# Altium project BallSensor16.PrjPcb
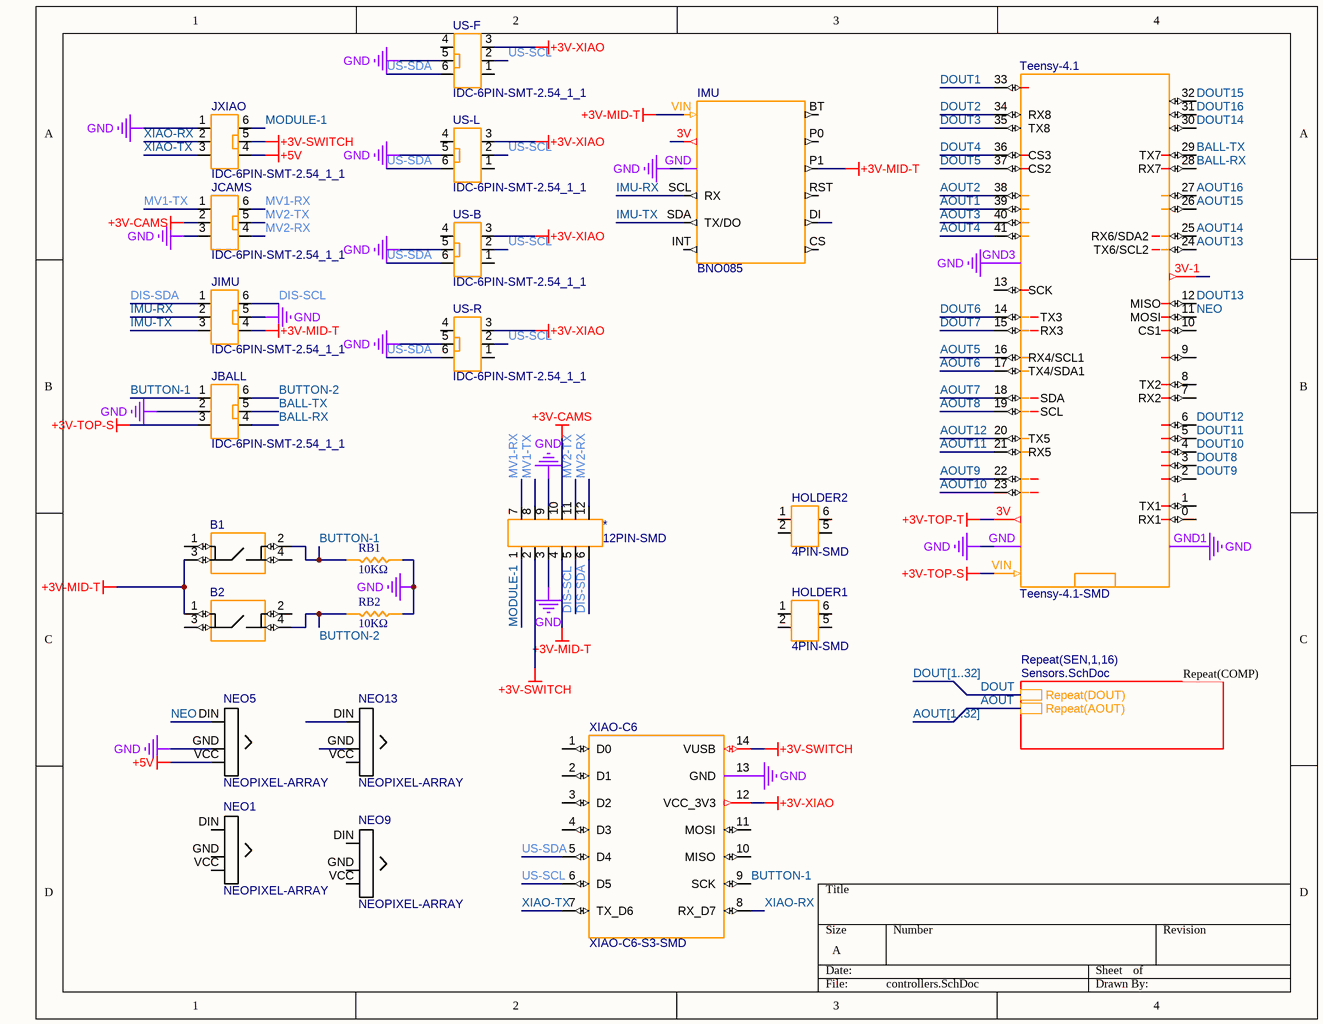
[diagram p0: controllers.SchDoc]
2 sheets, 86 parts. Net scope: hierarchical (ports join the sheet entries above them; power ports are global).
Board file: BallSensor16.PcbDoc
Sheets:
  controllers.SchDoc
    SEN1 = Sensors.SchDoc
    SEN2 = Sensors.SchDoc
    SEN3 = Sensors.SchDoc
    SEN4 = Sensors.SchDoc
    SEN5 = Sensors.SchDoc
    SEN6 = Sensors.SchDoc
    SEN7 = Sensors.SchDoc
    SEN8 = Sensors.SchDoc
    SEN9 = Sensors.SchDoc
    SEN10 = Sensors.SchDoc
    SEN11 = Sensors.SchDoc
    SEN12 = Sensors.SchDoc
    SEN13 = Sensors.SchDoc
    SEN14 = Sensors.SchDoc
    SEN15 = Sensors.SchDoc
    SEN16 = Sensors.SchDoc

## Sheet controllers.SchDoc
size A; SheetNumber: 1; SheetTotal: 2

### Parts
*  12PIN-SMD  [12PIN-SMD]
B1  BUTTON  [BUTTON]  (value not drawn)
B2  BUTTON  [BUTTON]  (value not drawn)
HOLDER1  4PIN-SMD  [4PIN-SMD]
HOLDER2  4PIN-SMD  [4PIN-SMD]
IMU  BNO085  [BNO085]
JBALL  IDC-6PIN-SMT-2.54_1_1  [IDC-6PIN-SMT-2.54]
JCAMS  IDC-6PIN-SMT-2.54_1_1  [IDC-6PIN-SMT-2.54]
JIMU  IDC-6PIN-SMT-2.54_1_1  [IDC-6PIN-SMT-2.54]
JXIAO  IDC-6PIN-SMT-2.54_1_1  [IDC-6PIN-SMT-2.54]
NEO1  NEOPIXEL-ARRAY  [NEOPIXEL-ARRAY]
NEO5  NEOPIXEL-ARRAY  [NEOPIXEL-ARRAY]
NEO9  NEOPIXEL-ARRAY  [NEOPIXEL-ARRAY]
NEO13  NEOPIXEL-ARRAY  [NEOPIXEL-ARRAY]
RB1  10KΩ  [RES_0603]
RB2  10KΩ  [RES_0603]
Teensy-4.1  Teensy-4.1-SMD  [TEENSY-4.1-SMD]
US-B  IDC-6PIN-SMT-2.54_1_1  [IDC-6PIN-SMT-2.54]
US-F  IDC-6PIN-SMT-2.54_1_1  [IDC-6PIN-SMT-2.54]
US-L  IDC-6PIN-SMT-2.54_1_1  [IDC-6PIN-SMT-2.54]
US-R  IDC-6PIN-SMT-2.54_1_1  [IDC-6PIN-SMT-2.54]
XIAO-C6  XIAO-C6-S3-SMD  [XIAO-C6-S3-SMD]

### Sub-sheets
Repeat(SEN,1,16) = Sensors.SchDoc: Repeat(DOUT), Repeat(AOUT)

### Nets
+3V-CAMS: *.10 JCAMS.2
+3V-MID-T: *.4 B1.3 B2.1 IMU.P1 IMU.VIN JIMU.4
+3V-SWITCH: *.2 JXIAO.5 XIAO-C6.14(VUSB)
+3V-TOP-S: JBALL.3 Teensy-4.1.VIN
+3V-TOP-T: Teensy-4.1.3V
+3V-XIAO: US-B.3 US-F.3 US-L.3 US-R.3 XIAO-C6.12(VCC_3V3)
+5V: JXIAO.4 NEO5.VCC
GND: *.3 *.9 IMU.GND JBALL.2 JCAMS.3 JIMU.5 JXIAO.1 NEO5.GND RB1.2 RB2.2 Teensy-4.1.GND Teensy-4.1.GND1 Teensy-4.1.GND3 US-B.5 US-F.5 US-L.5 US-R.5 XIAO-C6.13(GND)
AOUT: sheet Repeat(SEN,1,16)/Repeat(AOUT)
AOUT1: Teensy-4.1.39
AOUT2: Teensy-4.1.38
AOUT3: Teensy-4.1.40
AOUT4: Teensy-4.1.41
AOUT5: Teensy-4.1.16(RX4/SCL1)
AOUT6: Teensy-4.1.17(TX4/SDA1)
AOUT7: Teensy-4.1.18(SDA)
AOUT8: Teensy-4.1.19(SCL)
AOUT9: Teensy-4.1.22
AOUT10: Teensy-4.1.23
AOUT11: Teensy-4.1.21(RX5)
AOUT12: Teensy-4.1.20(TX5)
AOUT13: Teensy-4.1.24(TX6/SCL2)
AOUT14: Teensy-4.1.25(RX6/SDA2)
AOUT15: Teensy-4.1.26
AOUT16: Teensy-4.1.27
BALL-RX: JBALL.4 Teensy-4.1.28(RX7)
BALL-TX: JBALL.5 Teensy-4.1.29(TX7)
BUTTON-1: B1.2 JBALL.1 RB1.1 XIAO-C6.9(SCK)
BUTTON-2: B2.4 JBALL.6 RB2.1
DIS-SCL: *.5 JIMU.6
DIS-SDA: *.6 JIMU.1
DOUT: sheet Repeat(SEN,1,16)/Repeat(DOUT)
DOUT1: Teensy-4.1.33
DOUT2: Teensy-4.1.34(RX8)
DOUT3: Teensy-4.1.35(TX8)
DOUT4: Teensy-4.1.36(CS3)
DOUT5: Teensy-4.1.37(CS2)
DOUT6: Teensy-4.1.14(TX3)
DOUT7: Teensy-4.1.15(RX3)
DOUT8: Teensy-4.1.3
DOUT9: Teensy-4.1.2
DOUT10: Teensy-4.1.4
DOUT11: Teensy-4.1.5
DOUT12: Teensy-4.1.6
DOUT13: Teensy-4.1.12(MISO)
DOUT14: Teensy-4.1.30
DOUT15: Teensy-4.1.32
DOUT16: Teensy-4.1.31
IMU-RX: IMU.SCL(RX) JIMU.2
IMU-TX: IMU.SDA(TX/DO) JIMU.3
MODULE-1: *.1 JXIAO.6
MV1-RX: *.7 JCAMS.6
MV1-TX: *.8 JCAMS.1
MV2-RX: *.12 JCAMS.4
MV2-TX: *.11 JCAMS.5
NEO: NEO5.DIN Teensy-4.1.11(MOSI)
US-SCL: US-B.2 US-F.2 US-L.2 US-R.2 XIAO-C6.6(D5)
US-SDA: US-B.6 US-F.6 US-L.6 US-R.6 XIAO-C6.5(D4)
XIAO-RX: JXIAO.2 XIAO-C6.8(RX_D7)
XIAO-TX: JXIAO.3 XIAO-C6.7(TX_D6)

Not connected (* = marked no-connect by the designer): B1 1 4; B2 2 3; HOLDER1 1 2 5 6; HOLDER2 1 2 5 6; IMU 3V BT CS DI INT P0 RST; NEO1 DIN GND VCC; NEO9 DIN GND VCC; NEO13 DIN GND VCC; Teensy-4.1 0(RX1) 1(TX1) 3V-1 7(RX2) 8(TX2) 9 10(CS1) 13(SCK); US-B 1 4; US-F 1 4; US-L 1 4; US-R 1 4; XIAO-C6 1(D0) 2(D1) 3(D2) 4(D3) 10(MISO) 11(MOSI)

### Buses and harness runs
bus AOUT[1..32]
bus DOUT[1..32]

### Notes on the sheet
- Repeat(COMP)

### Library data of the parts
RB1 RB2 = RES_0603: Resistor SMD 0603 generic

## Sheet Sensors.SchDoc
size A; SheetNumber: 2; SheetTotal: 2
Used 16 times, as channels SEN1, SEN2, SEN3, SEN4, SEN5, SEN6, SEN7, SEN8, SEN9, SEN10, SEN11, SEN12, SEN13, SEN14, SEN15, SEN16. Parts and nets are listed once, with the designators drawn on the sheet.
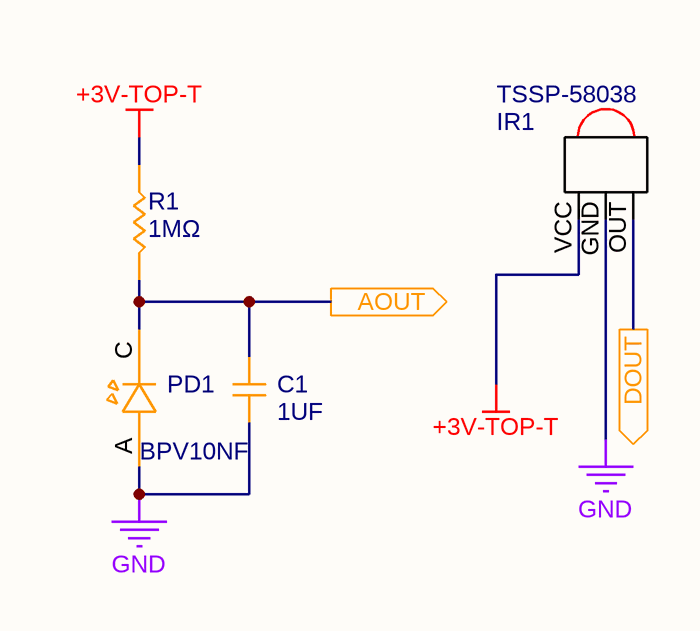
[diagram p1: Sensors.SchDoc]

### Parts
C1  1UF  [CAP_0603]
IR1  TSSP-58038  [TSSP-58038]
PD1  BPV10NF  [BPV10NF]
R1  1MΩ  [RES_0603]

### Ports
AOUT (out, see controllers[4C]), DOUT (out, see controllers[4C])

### Nets
+3V-TOP-T: IR1.VCC R1.2
GND: C1.2 IR1.GND PD1.A
AOUT: C1.1 PD1.C R1.1 ; port AOUT
DOUT: IR1.OUT ; port DOUT

### Channels
SEN1: designators end in _SEN1; ports AOUT=AOUT1 DOUT=DOUT1
SEN2: designators end in _SEN2; ports AOUT=AOUT2 DOUT=DOUT2
SEN3: designators end in _SEN3; ports AOUT=AOUT3 DOUT=DOUT3
SEN4: designators end in _SEN4; ports AOUT=AOUT4 DOUT=DOUT4
SEN5: designators end in _SEN5; ports AOUT=AOUT5 DOUT=DOUT5
SEN6: designators end in _SEN6; ports AOUT=AOUT6 DOUT=DOUT6
SEN7: designators end in _SEN7; ports AOUT=AOUT7 DOUT=DOUT7
SEN8: designators end in _SEN8; ports AOUT=AOUT8 DOUT=DOUT8
SEN9: designators end in _SEN9; ports AOUT=AOUT9 DOUT=DOUT9
SEN10: designators end in _SEN10; ports AOUT=AOUT10 DOUT=DOUT10
SEN11: designators end in _SEN11; ports AOUT=AOUT11 DOUT=DOUT11
SEN12: designators end in _SEN12; ports AOUT=AOUT12 DOUT=DOUT12
SEN13: designators end in _SEN13; ports AOUT=AOUT13 DOUT=DOUT13
SEN14: designators end in _SEN14; ports AOUT=AOUT14 DOUT=DOUT14
SEN15: designators end in _SEN15; ports AOUT=AOUT15 DOUT=DOUT15
SEN16: designators end in _SEN16; ports AOUT=AOUT16 DOUT=DOUT16

### Library data of the parts
C1 = CAP_0603: Capacitor SMD 0603 generic
R1 = RES_0603: Resistor SMD 0603 generic

## Nets that join several sheets
+3V-TOP-T: controllers (Teensy-4.1.3V), SEN1 (IR1_SEN1.VCC R1_SEN1.2), SEN2 (IR1_SEN2.VCC R1_SEN2.2), SEN3 (IR1_SEN3.VCC R1_SEN3.2), SEN4 (IR1_SEN4.VCC R1_SEN4.2), SEN5 (IR1_SEN5.VCC R1_SEN5.2), SEN6 (IR1_SEN6.VCC R1_SEN6.2), SEN7 (IR1_SEN7.VCC R1_SEN7.2), SEN8 (IR1_SEN8.VCC R1_SEN8.2), SEN9 (IR1_SEN9.VCC R1_SEN9.2), SEN10 (IR1_SEN10.VCC R1_SEN10.2), SEN11 (IR1_SEN11.VCC R1_SEN11.2), SEN12 (IR1_SEN12.VCC R1_SEN12.2), SEN13 (IR1_SEN13.VCC R1_SEN13.2), SEN14 (IR1_SEN14.VCC R1_SEN14.2), SEN15 (IR1_SEN15.VCC R1_SEN15.2), SEN16 (IR1_SEN16.VCC R1_SEN16.2)
GND: controllers (18 pins), SEN1 (C1_SEN1.2 IR1_SEN1.GND PD1_SEN1.A), SEN2 (C1_SEN2.2 IR1_SEN2.GND PD1_SEN2.A), SEN3 (C1_SEN3.2 IR1_SEN3.GND PD1_SEN3.A), SEN4 (C1_SEN4.2 IR1_SEN4.GND PD1_SEN4.A), SEN5 (C1_SEN5.2 IR1_SEN5.GND PD1_SEN5.A), SEN6 (C1_SEN6.2 IR1_SEN6.GND PD1_SEN6.A), SEN7 (C1_SEN7.2 IR1_SEN7.GND PD1_SEN7.A), SEN8 (C1_SEN8.2 IR1_SEN8.GND PD1_SEN8.A), SEN9 (C1_SEN9.2 IR1_SEN9.GND PD1_SEN9.A), SEN10 (C1_SEN10.2 IR1_SEN10.GND PD1_SEN10.A), SEN11 (C1_SEN11.2 IR1_SEN11.GND PD1_SEN11.A), SEN12 (C1_SEN12.2 IR1_SEN12.GND PD1_SEN12.A), SEN13 (C1_SEN13.2 IR1_SEN13.GND PD1_SEN13.A), SEN14 (C1_SEN14.2 IR1_SEN14.GND PD1_SEN14.A), SEN15 (C1_SEN15.2 IR1_SEN15.GND PD1_SEN15.A), SEN16 (C1_SEN16.2 IR1_SEN16.GND PD1_SEN16.A)
AOUT1: controllers (Teensy-4.1.39), SEN1 (C1_SEN1.1 PD1_SEN1.C R1_SEN1.1)
AOUT2: controllers (Teensy-4.1.38), SEN2 (C1_SEN2.1 PD1_SEN2.C R1_SEN2.1)
AOUT3: controllers (Teensy-4.1.40), SEN3 (C1_SEN3.1 PD1_SEN3.C R1_SEN3.1)
AOUT4: controllers (Teensy-4.1.41), SEN4 (C1_SEN4.1 PD1_SEN4.C R1_SEN4.1)
AOUT5: controllers (Teensy-4.1.16), SEN5 (C1_SEN5.1 PD1_SEN5.C R1_SEN5.1)
AOUT6: controllers (Teensy-4.1.17), SEN6 (C1_SEN6.1 PD1_SEN6.C R1_SEN6.1)
AOUT7: controllers (Teensy-4.1.18), SEN7 (C1_SEN7.1 PD1_SEN7.C R1_SEN7.1)
AOUT8: controllers (Teensy-4.1.19), SEN8 (C1_SEN8.1 PD1_SEN8.C R1_SEN8.1)
AOUT9: controllers (Teensy-4.1.22), SEN9 (C1_SEN9.1 PD1_SEN9.C R1_SEN9.1)
AOUT10: controllers (Teensy-4.1.23), SEN10 (C1_SEN10.1 PD1_SEN10.C R1_SEN10.1)
AOUT11: controllers (Teensy-4.1.21), SEN11 (C1_SEN11.1 PD1_SEN11.C R1_SEN11.1)
AOUT12: controllers (Teensy-4.1.20), SEN12 (C1_SEN12.1 PD1_SEN12.C R1_SEN12.1)
AOUT13: controllers (Teensy-4.1.24), SEN13 (C1_SEN13.1 PD1_SEN13.C R1_SEN13.1)
AOUT14: controllers (Teensy-4.1.25), SEN14 (C1_SEN14.1 PD1_SEN14.C R1_SEN14.1)
AOUT15: controllers (Teensy-4.1.26), SEN15 (C1_SEN15.1 PD1_SEN15.C R1_SEN15.1)
AOUT16: controllers (Teensy-4.1.27), SEN16 (C1_SEN16.1 PD1_SEN16.C R1_SEN16.1)
DOUT1: controllers (Teensy-4.1.33), SEN1 (IR1_SEN1.OUT)
DOUT2: controllers (Teensy-4.1.34), SEN2 (IR1_SEN2.OUT)
DOUT3: controllers (Teensy-4.1.35), SEN3 (IR1_SEN3.OUT)
DOUT4: controllers (Teensy-4.1.36), SEN4 (IR1_SEN4.OUT)
DOUT5: controllers (Teensy-4.1.37), SEN5 (IR1_SEN5.OUT)
DOUT6: controllers (Teensy-4.1.14), SEN6 (IR1_SEN6.OUT)
DOUT7: controllers (Teensy-4.1.15), SEN7 (IR1_SEN7.OUT)
DOUT8: controllers (Teensy-4.1.3), SEN8 (IR1_SEN8.OUT)
DOUT9: controllers (Teensy-4.1.2), SEN9 (IR1_SEN9.OUT)
DOUT10: controllers (Teensy-4.1.4), SEN10 (IR1_SEN10.OUT)
DOUT11: controllers (Teensy-4.1.5), SEN11 (IR1_SEN11.OUT)
DOUT12: controllers (Teensy-4.1.6), SEN12 (IR1_SEN12.OUT)
DOUT13: controllers (Teensy-4.1.12), SEN13 (IR1_SEN13.OUT)
DOUT14: controllers (Teensy-4.1.30), SEN14 (IR1_SEN14.OUT)
DOUT15: controllers (Teensy-4.1.32), SEN15 (IR1_SEN15.OUT)
DOUT16: controllers (Teensy-4.1.31), SEN16 (IR1_SEN16.OUT)